# Altium schematic sheet MCP2518_PINOUT.SchDoc
size A4; SheetNumber: 4; SheetTotal: 7
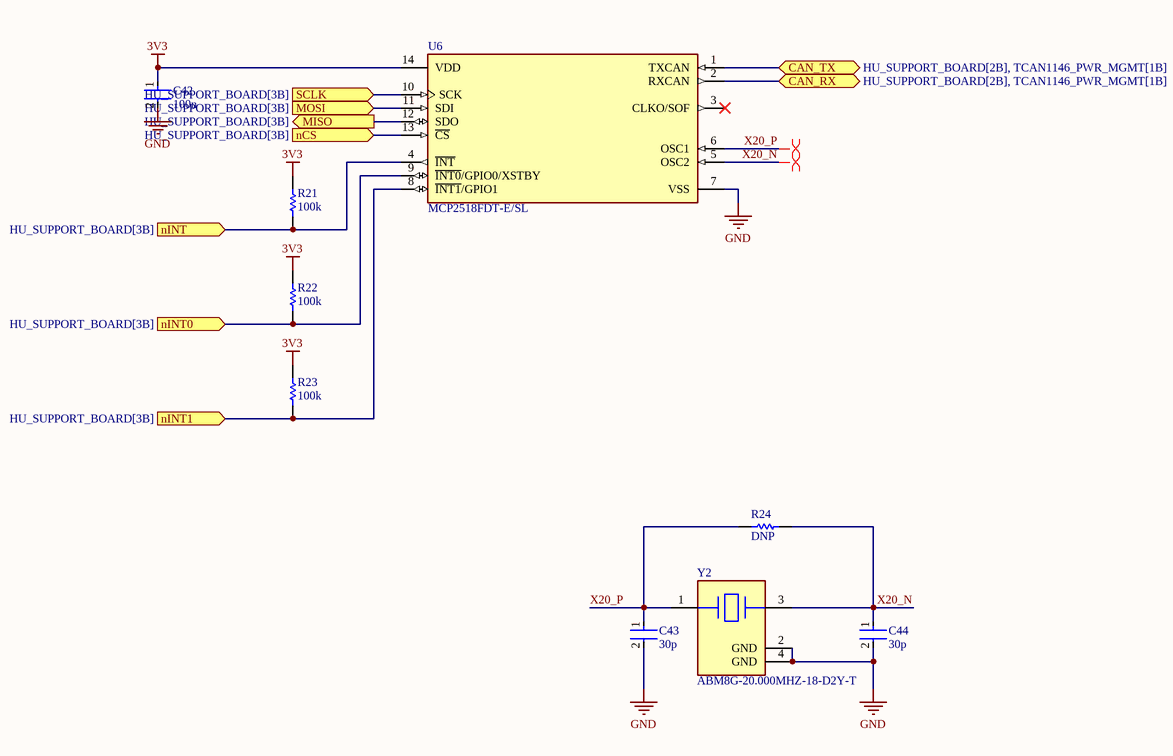
[diagram p0: MCP2518_PINOUT.SchDoc]

## Parts
C42  100n  [FP-0402-L_1_0_0_05-W_0_5-IPC_A]
C43  30p  [FP-0402-L_1_0_0_05-W_0_5-IPC_A]
C44  30p  [FP-0402-L_1_0_0_05-W_0_5-IPC_A]
R21  100k  [R0603B]
R22  100k  [R0603B]
R23  100k  [R0603B]
R24  DNP  [R0603B]
U6  MCP2518FDT-E/SL  [FP-C04-065-SL-IPC_C]
Y2  ABM8G-20.000MHZ-18-D2Y-T  [FP-ABM8G-MFG]

## Ports
CAN_RX (bidir, see HU_SUPPORT_BOARD[2B], TCAN1146_PWR_MGMT[1B]), CAN_TX (bidir, see HU_SUPPORT_BOARD[2B], TCAN1146_PWR_MGMT[1B]), MISO (out, see HU_SUPPORT_BOARD[3B]), MOSI (in, see HU_SUPPORT_BOARD[3B]), nCS (in, see HU_SUPPORT_BOARD[3B]), nINT0 (in, see HU_SUPPORT_BOARD[3B]), nINT1 (in, see HU_SUPPORT_BOARD[3B]), nINT (in, see HU_SUPPORT_BOARD[3B]), SCLK (in, see HU_SUPPORT_BOARD[3B])

## Nets
3V3: C42.1 R21.1 R22.1 R23.1 U6.14(VDD)
GND: C42.2 C43.2 C44.2 U6.7(VSS) Y2.2(GND) Y2.4(GND)
CAN_RX: U6.2(RXCAN) ; port CAN_RX
CAN_TX: U6.1(TXCAN) ; port CAN_TX
MISO: U6.12(SDO) ; port MISO
MOSI: U6.11(SDI) ; port MOSI
nCS: U6.13(~{CS}) ; port nCS
nINT: R21.2 U6.4(~{INT}) ; port nINT
nINT0: R22.2 U6.9(~{INT0}/GPIO0/XSTBY) ; port nINT0
nINT1: R23.2 U6.8(~{INT1}/GPIO1) ; port nINT1
SCLK: U6.10(SCK) ; port SCLK
X20_N: C44.1 R24.2 U6.5(OSC2) Y2.3
X20_P: C43.1 R24.1 U6.6(OSC1) Y2.1

Not connected (* = marked no-connect by the designer): U6 3(CLKO/SOF)*

## Layout directives
differential pair: X20_N, X20_P

## Library data of the parts
C42-C44 = CMP-001-00058-1: LARGE PADS, 0402 CAP, CHANGE COMMENT TO MATCH REAL P/N; Capacitor Type: Ceramic; Min Operating Temperature: -55°C; Mounting Technology: Surface Mount; Pins: 2; Case/Package: 0402; RoHS Compliant: Yes; Max Operating Temperature: 85°C
R21-R24 = CMP-009-00002-14: Resistor; Value: 330
U6 = CMP-06298-000019-1: IC CAN CONTROLLER SPI 14SOIC; RoHS Compliant: Yes
Y2 = CMP-27762-015817-1: Crystal 20MHz ±20ppm (Tol) ±30ppm (Stability) 18pF FUND 80Ω 4-Pin SMD T/R; ESR (Equivalent Series Resistance): 80R; Termination: SMD/SMT; Length: 3.2mm; Packaging: Tape and Reel; Width: 2.5mm; Load Capacitance: 18pF; Height: 1mm; Min Operating Temperature: -40°C; Tolerance: 20ppm; Number of Pins: 4; Depth: 2.5mm; Series: ABM8G; Frequency: 20MHz; Package Quantity: 1000; Frequency Tolerance: 20ppm; Mount: Surface Mount; Max Operating Temperature: 85°C; Case/Package: CSMD; Frequency Stability: 30ppm